# EAGLE schematic SC_Detect (EAGLE 6.5.0)
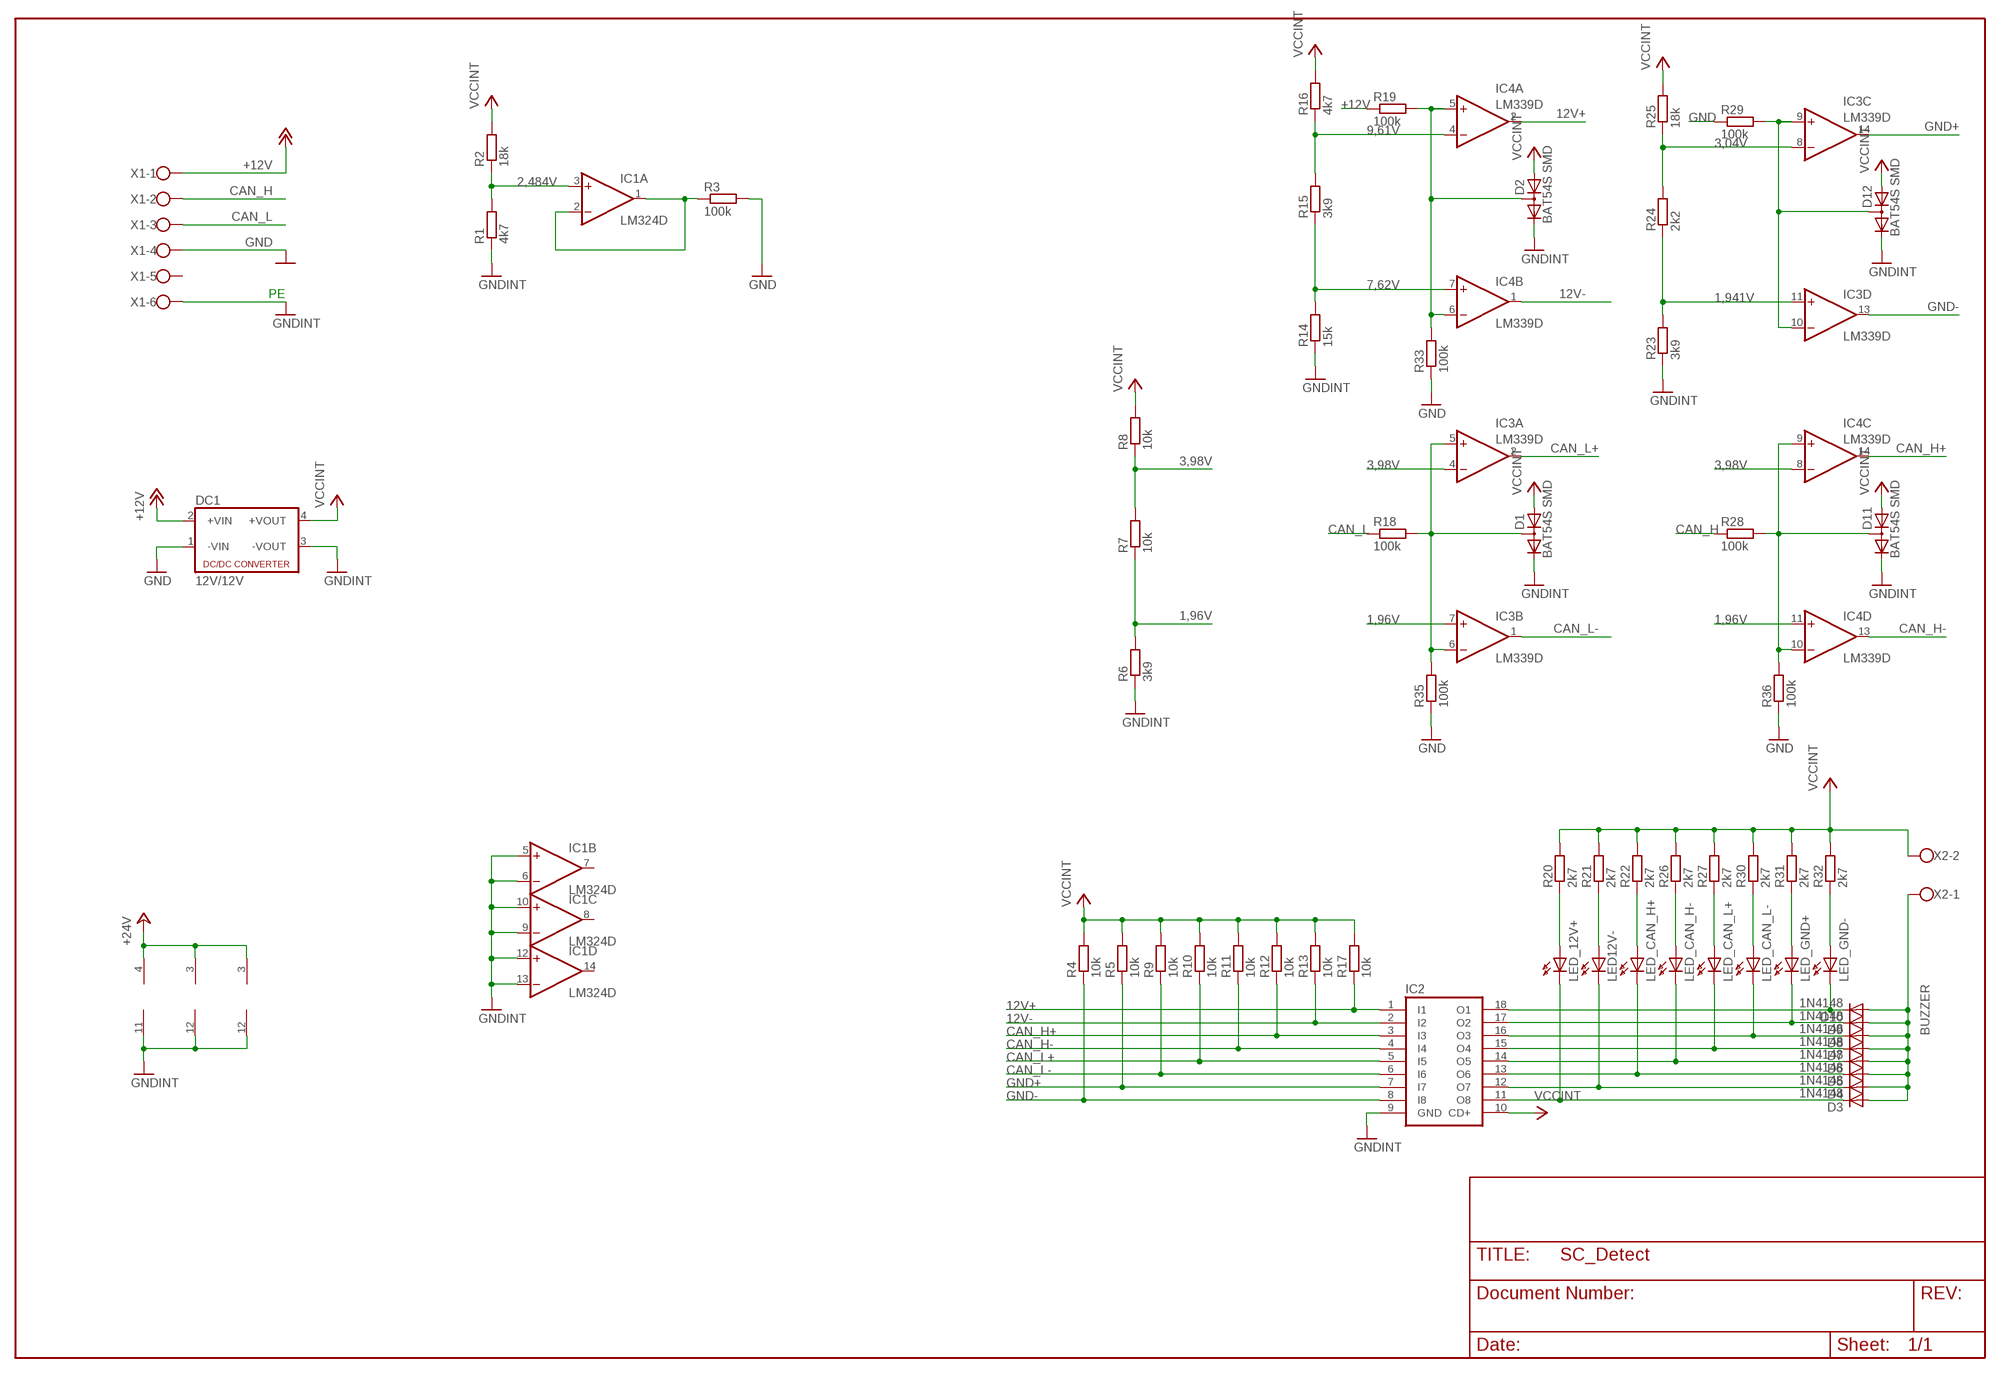
[diagram p0: schematic, sheet 1]

## Parts
D1  BAT54S SMD  DIODE_2CACA-SOT23  [SOT23]
D2  BAT54S SMD  DIODE_2CACA-SOT23  [SOT23]
D3  1N4148  DIODE-SOD80C  [SOD80C]
D4  1N4148  DIODE-SOD80C  [SOD80C]
D5  1N4148  DIODE-SOD80C  [SOD80C]
D6  1N4148  DIODE-SOD80C  [SOD80C]
D7  1N4148  DIODE-SOD80C  [SOD80C]
D8  1N4148  DIODE-SOD80C  [SOD80C]
D9  1N4148  DIODE-SOD80C  [SOD80C]
D10  1N4148  DIODE-SOD80C  [SOD80C]
D11  BAT54S SMD  DIODE_2CACA-SOT23  [SOT23]
D12  BAT54S SMD  DIODE_2CACA-SOT23  [SOT23]
DC1  12V/12V  NME  [NME]
IC1  LM324D  [SO14]
IC2  ULN2803AD  [SO18L]
IC3  LM339D  [SO14]
IC4  LM339D  [SO14]
LED12V-  LED_3MM_ST_RT  LED3MM  [LED3MM]
LED_12V+  LED_3MM_ST_RT  LED3MM  [LED3MM]
LED_CAN_H+  LED_3MM_ST_RT  LED3MM  [LED3MM]
LED_CAN_H-  LED_3MM_ST_RT  LED3MM  [LED3MM]
LED_CAN_L+  LED_3MM_ST_RT  LED3MM  [LED3MM]
LED_CAN_L-  LED_3MM_ST_RT  LED3MM  [LED3MM]
LED_GND+  LED_3MM_ST_RT  LED3MM  [LED3MM]
LED_GND-  LED_3MM_ST_RT  LED3MM  [LED3MM]
R1  4k7  R-EU_R0805  [R0805]
R2  18k  R-EU_R0805  [R0805]
R3  100k  R-EU_R0805  [R0805]
R4  10k  R-EU_R0805  [R0805]
R5  10k  R-EU_R0805  [R0805]
R6  3k9  R-EU_R0805  [R0805]
R7  10k  R-EU_R0805  [R0805]
R8  10k  R-EU_R0805  [R0805]
R9  10k  R-EU_R0805  [R0805]
R10  10k  R-EU_R0805  [R0805]
R11  10k  R-EU_R0805  [R0805]
R12  10k  R-EU_R0805  [R0805]
R13  10k  R-EU_R0805  [R0805]
R14  15k  R-EU_R0805  [R0805]
R15  3k9  R-EU_R0805  [R0805]
R16  4k7  R-EU_R0805  [R0805]
R17  10k  R-EU_R0805  [R0805]
R18  100k  R-EU_R0805  [R0805]
R19  100k  R-EU_R0805  [R0805]
R20  2k7  R-EU_R0805  [R0805]
R21  2k7  R-EU_R0805  [R0805]
R22  2k7  R-EU_R0805  [R0805]
R23  3k9  R-EU_R0805  [R0805]
R24  2k2  R-EU_R0805  [R0805]
R25  18k  R-EU_R0805  [R0805]
R26  2k7  R-EU_R0805  [R0805]
R27  2k7  R-EU_R0805  [R0805]
R28  100k  R-EU_R0805  [R0805]
R29  100k  R-EU_R0805  [R0805]
R30  2k7  R-EU_R0805  [R0805]
R31  2k7  R-EU_R0805  [R0805]
R32  2k7  R-EU_R0805  [R0805]
R33  100k  R-EU_R0805  [R0805]
R35  100k  R-EU_R0805  [R0805]
R36  100k  R-EU_R0805  [R0805]
X1  W237-136  [W237-136]
X2  W237-102  [W237-102]

## Nets
1,96V: IC3.7(B:+IN) IC4.11(D:+IN) R6.2 R7.1
1,941V: IC3.11(D:+IN) R23.2 R24.1
2,484V: IC1.3(A:+IN) R1.2 R2.1
3,04V: IC3.8(C:-IN) R24.2 R25.1
3,98V: IC3.4(A:-IN) IC4.8(C:-IN) R7.2 R8.1
7,62V: IC4.7(B:+IN) R14.2 R15.1
9,61V: IC4.4(A:-IN) R15.2 R16.1
12V+: IC2.1(I1) IC4.2(A:OUT) R17.1
12V+1: D10.C IC2.18(O1) LED_GND-.K(C)
12V-: IC2.2(I2) IC4.1(B:OUT) R13.1
+12V: DC1.2(+VIN) R19.1 X1.1
BUZZER: D3.A D4.A D5.A D6.A D7.A D8.A D9.A D10.A X2.1
CAN_H: R28.1 X1.2
CAN_H+: IC2.3(I3) IC4.14(C:OUT) R12.1
CAN_H-: IC2.4(I4) IC4.13(D:OUT) R11.1
CAN_L: R18.1 X1.3
CAN_L+: IC2.5(I5) IC3.2(A:OUT) R10.1
CAN_L-: IC2.6(I6) IC3.1(B:OUT) R9.1
GND: DC1.1(-VIN) R3.2 R29.1 R33.1 R35.1 R36.1 X1.4
GND+: IC2.7(I7) IC3.14(C:OUT) R5.1
GND-: IC2.8(I8) IC3.13(D:OUT) R4.1
GNDINT: D1.2(C) D2.2(C) D11.2(C) D12.2(C) DC1.3(-VOUT) IC1.5(B:+IN) IC1.6(B:-IN) IC1.9(C:-IN) IC1.10(C:+IN) IC1.11(P:V-) IC1.12(D:+IN) IC1.13(D:-IN) IC2.9(GND) IC3.12(P:V-) IC4.12(P:V-) R1.1 R6.1 R14.1 R23.1 X1.6
N$1: IC1.1(A:OUT) IC1.2(A:-IN) R3.1
N$2: LED_GND-.A R32.1
N$3: LED_GND+.A R31.1
N$4: LED_CAN_L-.A R30.1
N$5: LED_CAN_L+.A R27.1
N$6: LED_CAN_H-.A R26.1
N$8: LED_CAN_H+.A R22.1
N$9: LED12V-.A R21.1
N$10: D12.3(AC) IC3.9(C:+IN) IC3.10(D:-IN) R29.2
N$11: D11.3(AC) IC4.9(C:+IN) IC4.10(D:-IN) R28.2 R36.2
N$12: LED_12V+.A R20.1
N$14: D3.C IC2.11(O8) LED_12V+.K(C)
N$15: D4.C IC2.12(O7) LED12V-.K(C)
N$16: D2.3(AC) IC4.5(A:+IN) IC4.6(B:-IN) R19.2 R33.2
N$17: D5.C IC2.13(O6) LED_CAN_H+.K(C)
N$18: D6.C IC2.14(O5) LED_CAN_H-.K(C)
N$19: D7.C IC2.15(O4) LED_CAN_L+.K(C)
N$20: D8.C IC2.16(O3) LED_CAN_L-.K(C)
N$21: D9.C IC2.17(O2) LED_GND+.K(C)
N$23: D1.3(AC) IC3.5(A:+IN) IC3.6(B:-IN) R18.2 R35.2
VCCINT: D1.1(A) D2.1(A) D11.1(A) D12.1(A) DC1.4(+VOUT) IC1.4(P:V+) IC2.10(CD+) IC3.3(P:V+) IC4.3(P:V+) R2.2 R4.2 R5.2 R8.2 R9.2 R10.2 R11.2 R12.2 R13.2 R16.2 R17.2 R20.2 R21.2 R22.2 R25.2 R26.2 R27.2 R30.2 R31.2 R32.2 X2.2 ; supply symbol labelled +24V
Unconnected: IC1.7(B:OUT) IC1.8(C:OUT) IC1.14(D:OUT) X1.5

## Notes on the sheet
- PE

## Library data of the parts
D1 D2 D11 D12 = diode:DIODE_2CACA-: 2 Diodes - Cathode-Anode|Cathode-Anode
D3-D10 = diode:DIODE-: DIODE
DC1 = dc-dc-converter:NME: DC-DC CONVERTER
IC1 = linear:LM324: OP AMP
IC2 = uln-udn:ULN2803A: DRIVER ARRAY
IC3 IC4 = linear:LM339: COMPARATOR
LED12V- LED_12V+ LED_CAN_H+ LED_CAN_H- LED_CAN_L+ LED_CAN_L- LED_GND+ LED_GND- = led:LED: LED
R1-R33 R35 R36 = rcl:R-EU_: RESISTOR, European symbol
X1 = con-wago-500:W237-136: WAGO SCREW CLAMP
X2 = con-wago-500:W237-102: WAGO SCREW CLAMP